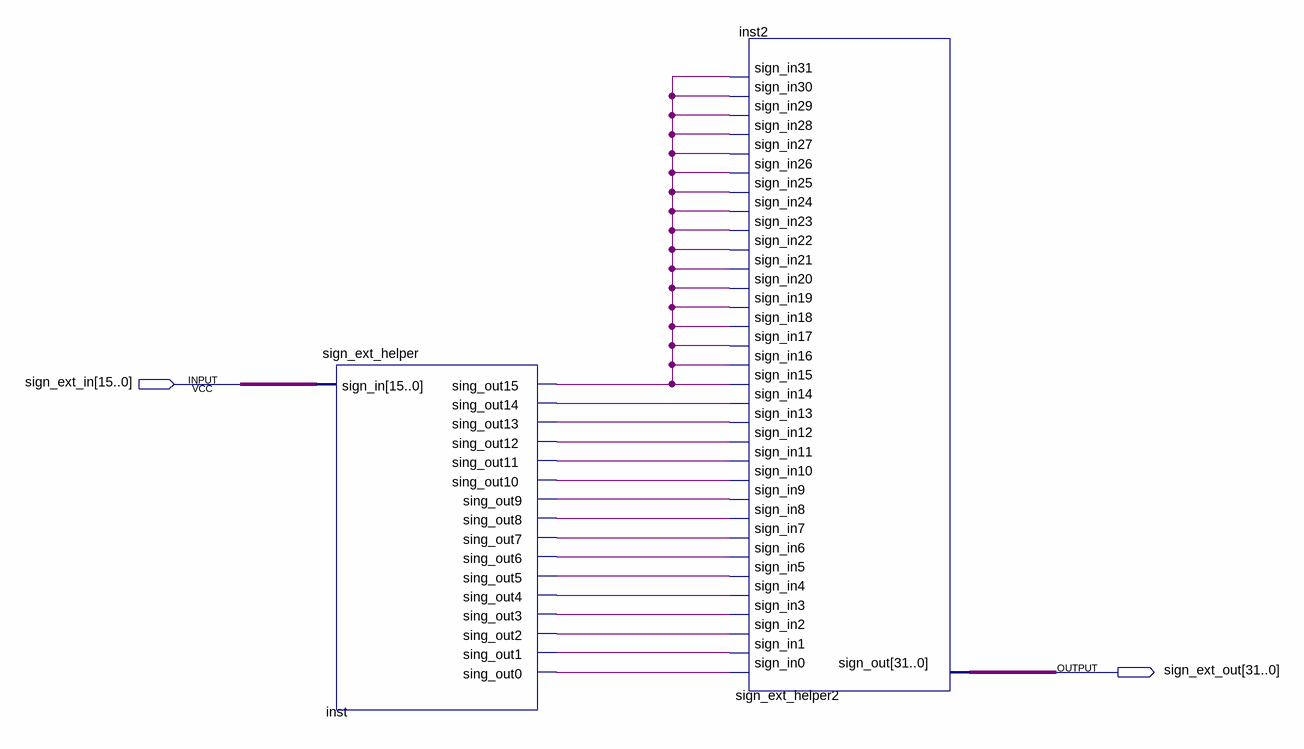
[diagram p0: schematic sheet]
// Quartus schematic sign_ext.bdf as structural Verilog: 2 symbols, 2 pins
module sign_ext (
  input  [15:0] sign_ext_in,
  output [31:0] sign_ext_out
);

  wire inst_sing_out0, inst_sing_out1, inst_sing_out2, inst_sing_out3, inst_sing_out4, inst_sing_out5,
       inst_sing_out6, inst_sing_out7, inst_sing_out8, inst_sing_out9, inst_sing_out10, inst_sing_out11,
       inst_sing_out12, inst_sing_out13, inst_sing_out14, inst_sing_out15;

  sign_ext_helper inst (
    .sign_in(sign_ext_in), .sing_out15(inst_sing_out15), .sing_out14(inst_sing_out14),
    .sing_out13(inst_sing_out13), .sing_out12(inst_sing_out12), .sing_out11(inst_sing_out11),
    .sing_out10(inst_sing_out10), .sing_out9(inst_sing_out9), .sing_out8(inst_sing_out8),
    .sing_out7(inst_sing_out7), .sing_out6(inst_sing_out6), .sing_out5(inst_sing_out5),
    .sing_out4(inst_sing_out4), .sing_out3(inst_sing_out3), .sing_out2(inst_sing_out2),
    .sing_out1(inst_sing_out1), .sing_out0(inst_sing_out0));
  sign_ext_helper2 inst2 (
    .sign_in0(inst_sing_out0), .sign_in1(inst_sing_out1), .sign_in2(inst_sing_out2),
    .sign_in3(inst_sing_out3), .sign_in4(inst_sing_out4), .sign_in5(inst_sing_out5),
    .sign_in6(inst_sing_out6), .sign_in7(inst_sing_out7), .sign_in8(inst_sing_out8),
    .sign_in9(inst_sing_out9), .sign_in10(inst_sing_out10), .sign_in11(inst_sing_out11),
    .sign_in12(inst_sing_out12), .sign_in13(inst_sing_out13), .sign_in14(inst_sing_out14),
    .sign_in15(inst_sing_out15), .sign_in16(inst_sing_out15), .sign_in17(inst_sing_out15),
    .sign_in18(inst_sing_out15), .sign_in19(inst_sing_out15), .sign_in20(inst_sing_out15),
    .sign_in21(inst_sing_out15), .sign_in22(inst_sing_out15), .sign_in23(inst_sing_out15),
    .sign_in24(inst_sing_out15), .sign_in25(inst_sing_out15), .sign_in26(inst_sing_out15),
    .sign_in27(inst_sing_out15), .sign_in28(inst_sing_out15), .sign_in29(inst_sing_out15),
    .sign_in30(inst_sing_out15), .sign_in31(inst_sing_out15), .sign_out(sign_ext_out));
endmodule
